# EasyEDA schematic SCH_STM32CRONOS_SQUEM.json

## Sheets
1 Sheet_1: TITLE: Sheet_1; REV: 1.0; Date: 2024-10-26; Sheet: 1/1; Drawn By: jbgs_ch_mex; Company: Your Company
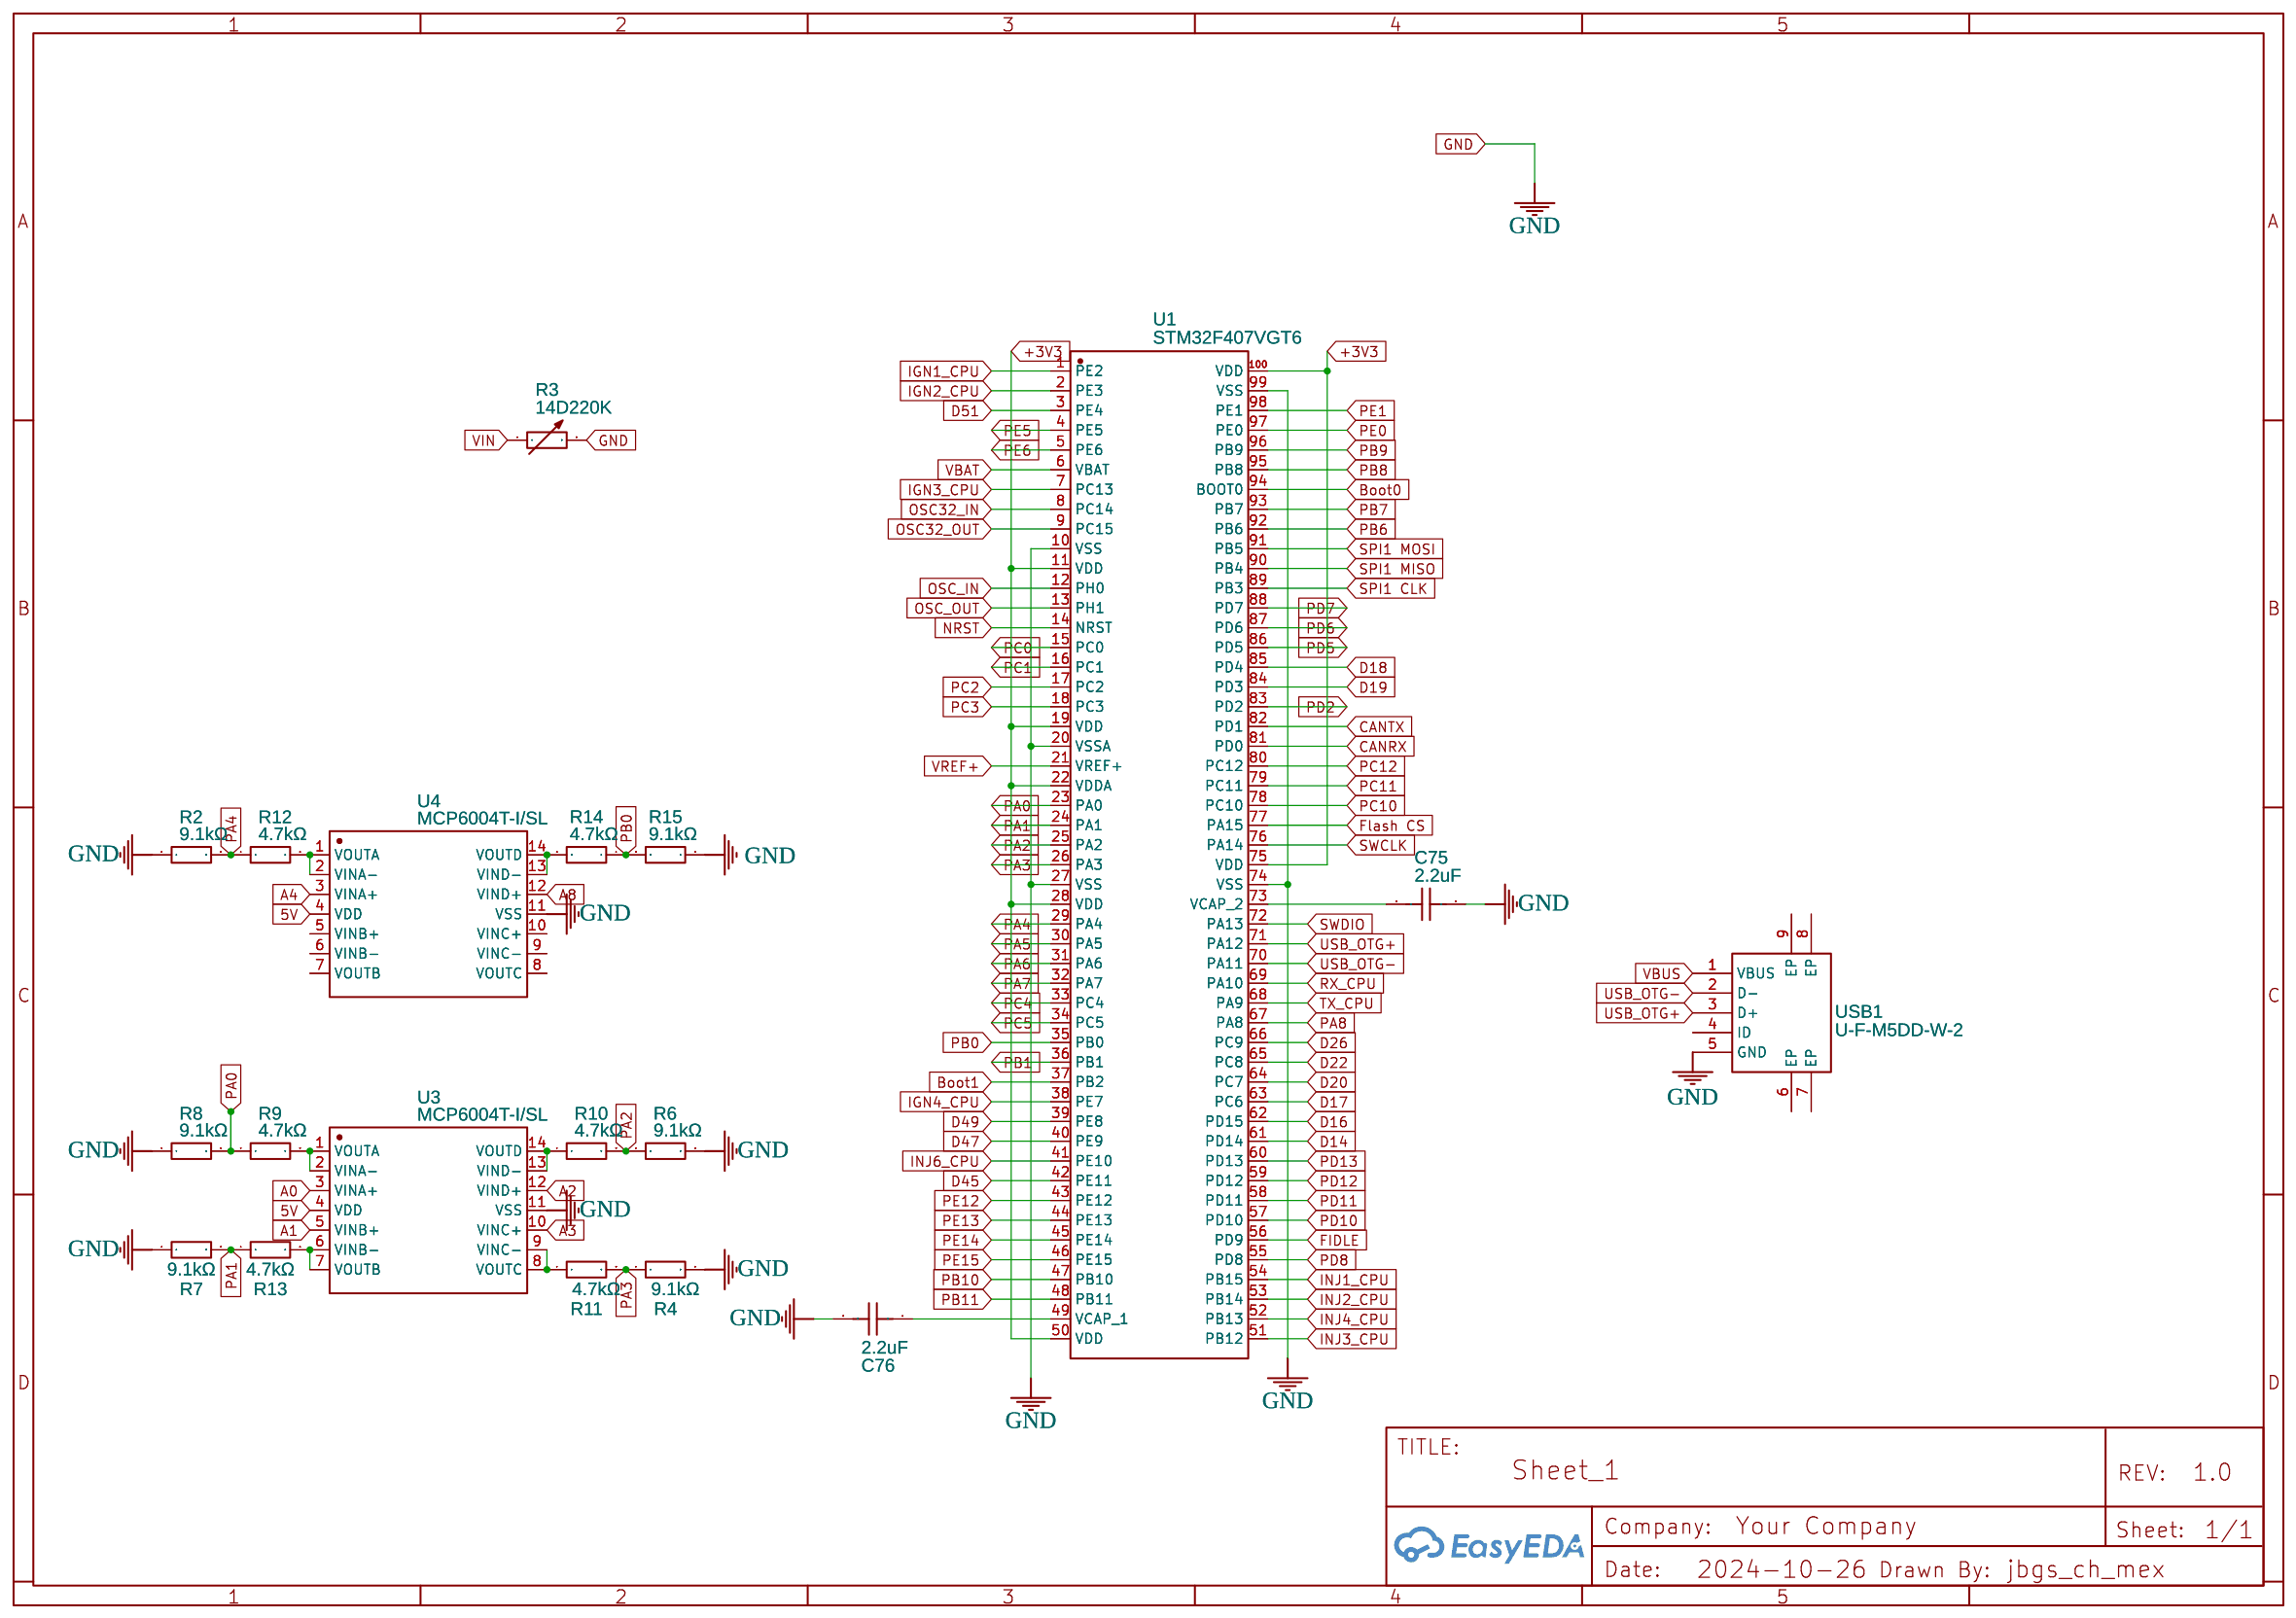
[diagram p0: Sheet_1]
2 Sheet_2: TITLE: Sheet_2
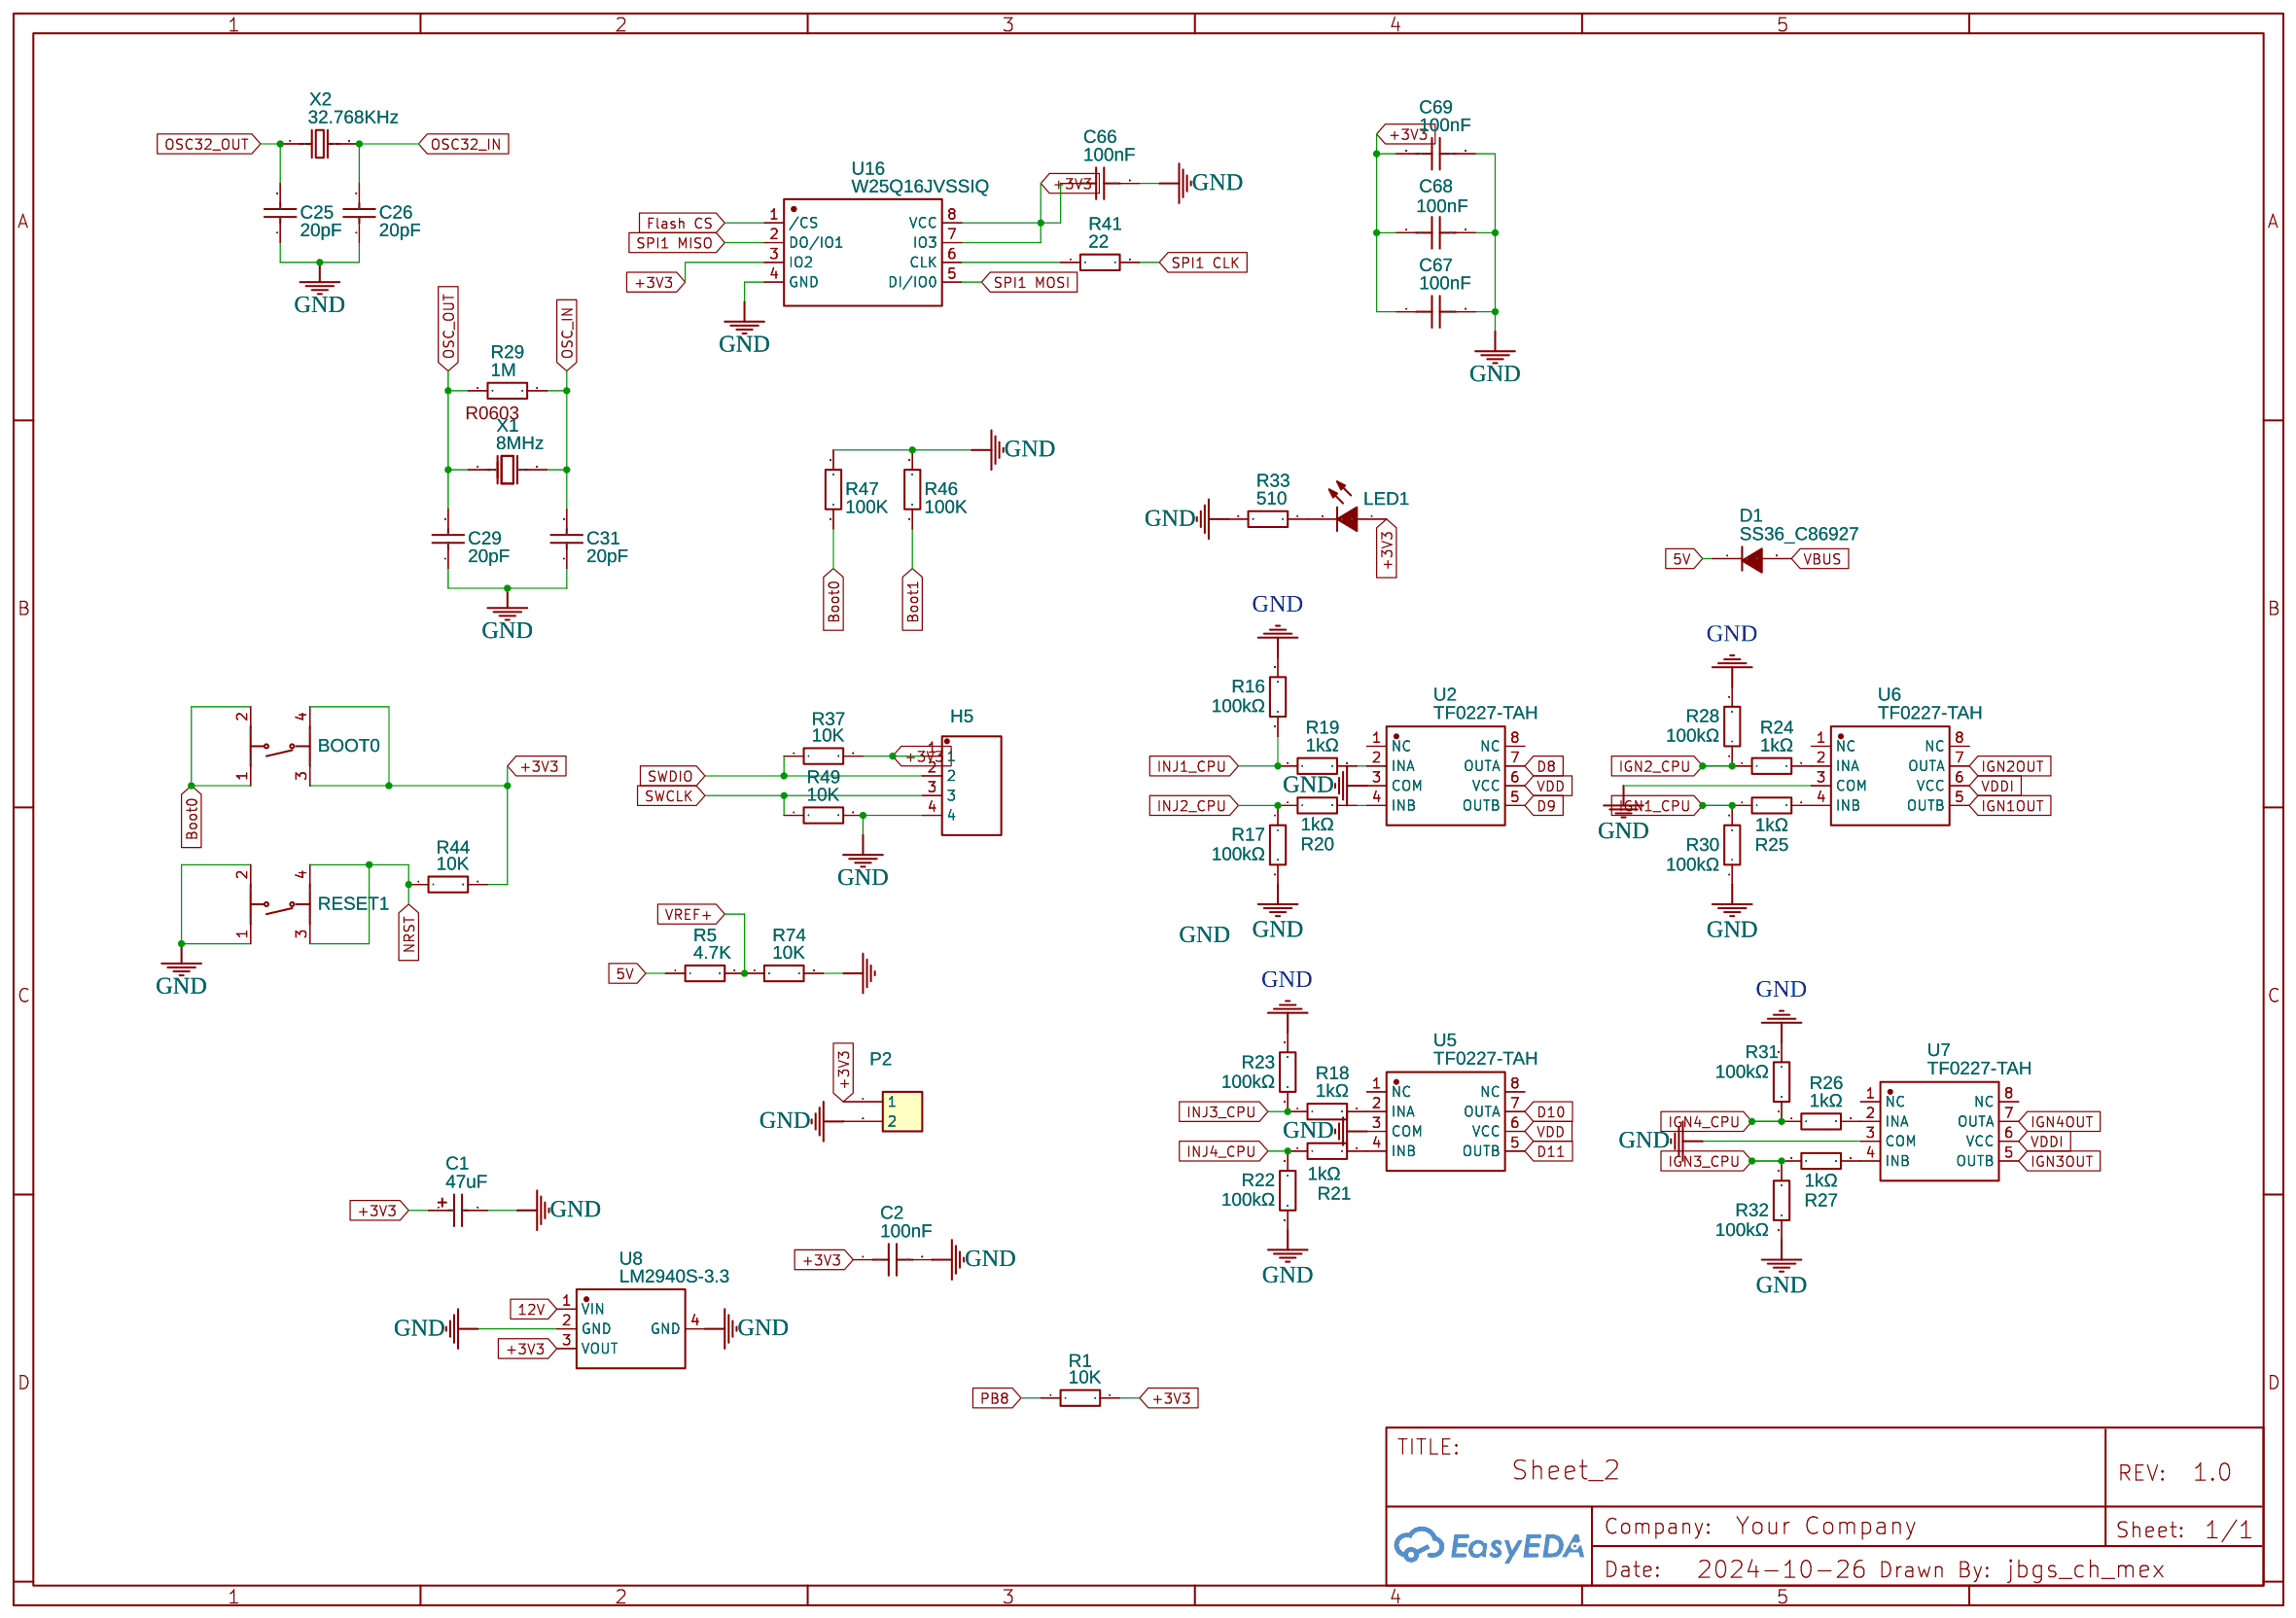
[diagram p1: Sheet_2]
3 Sheet_3: TITLE: Sheet_3
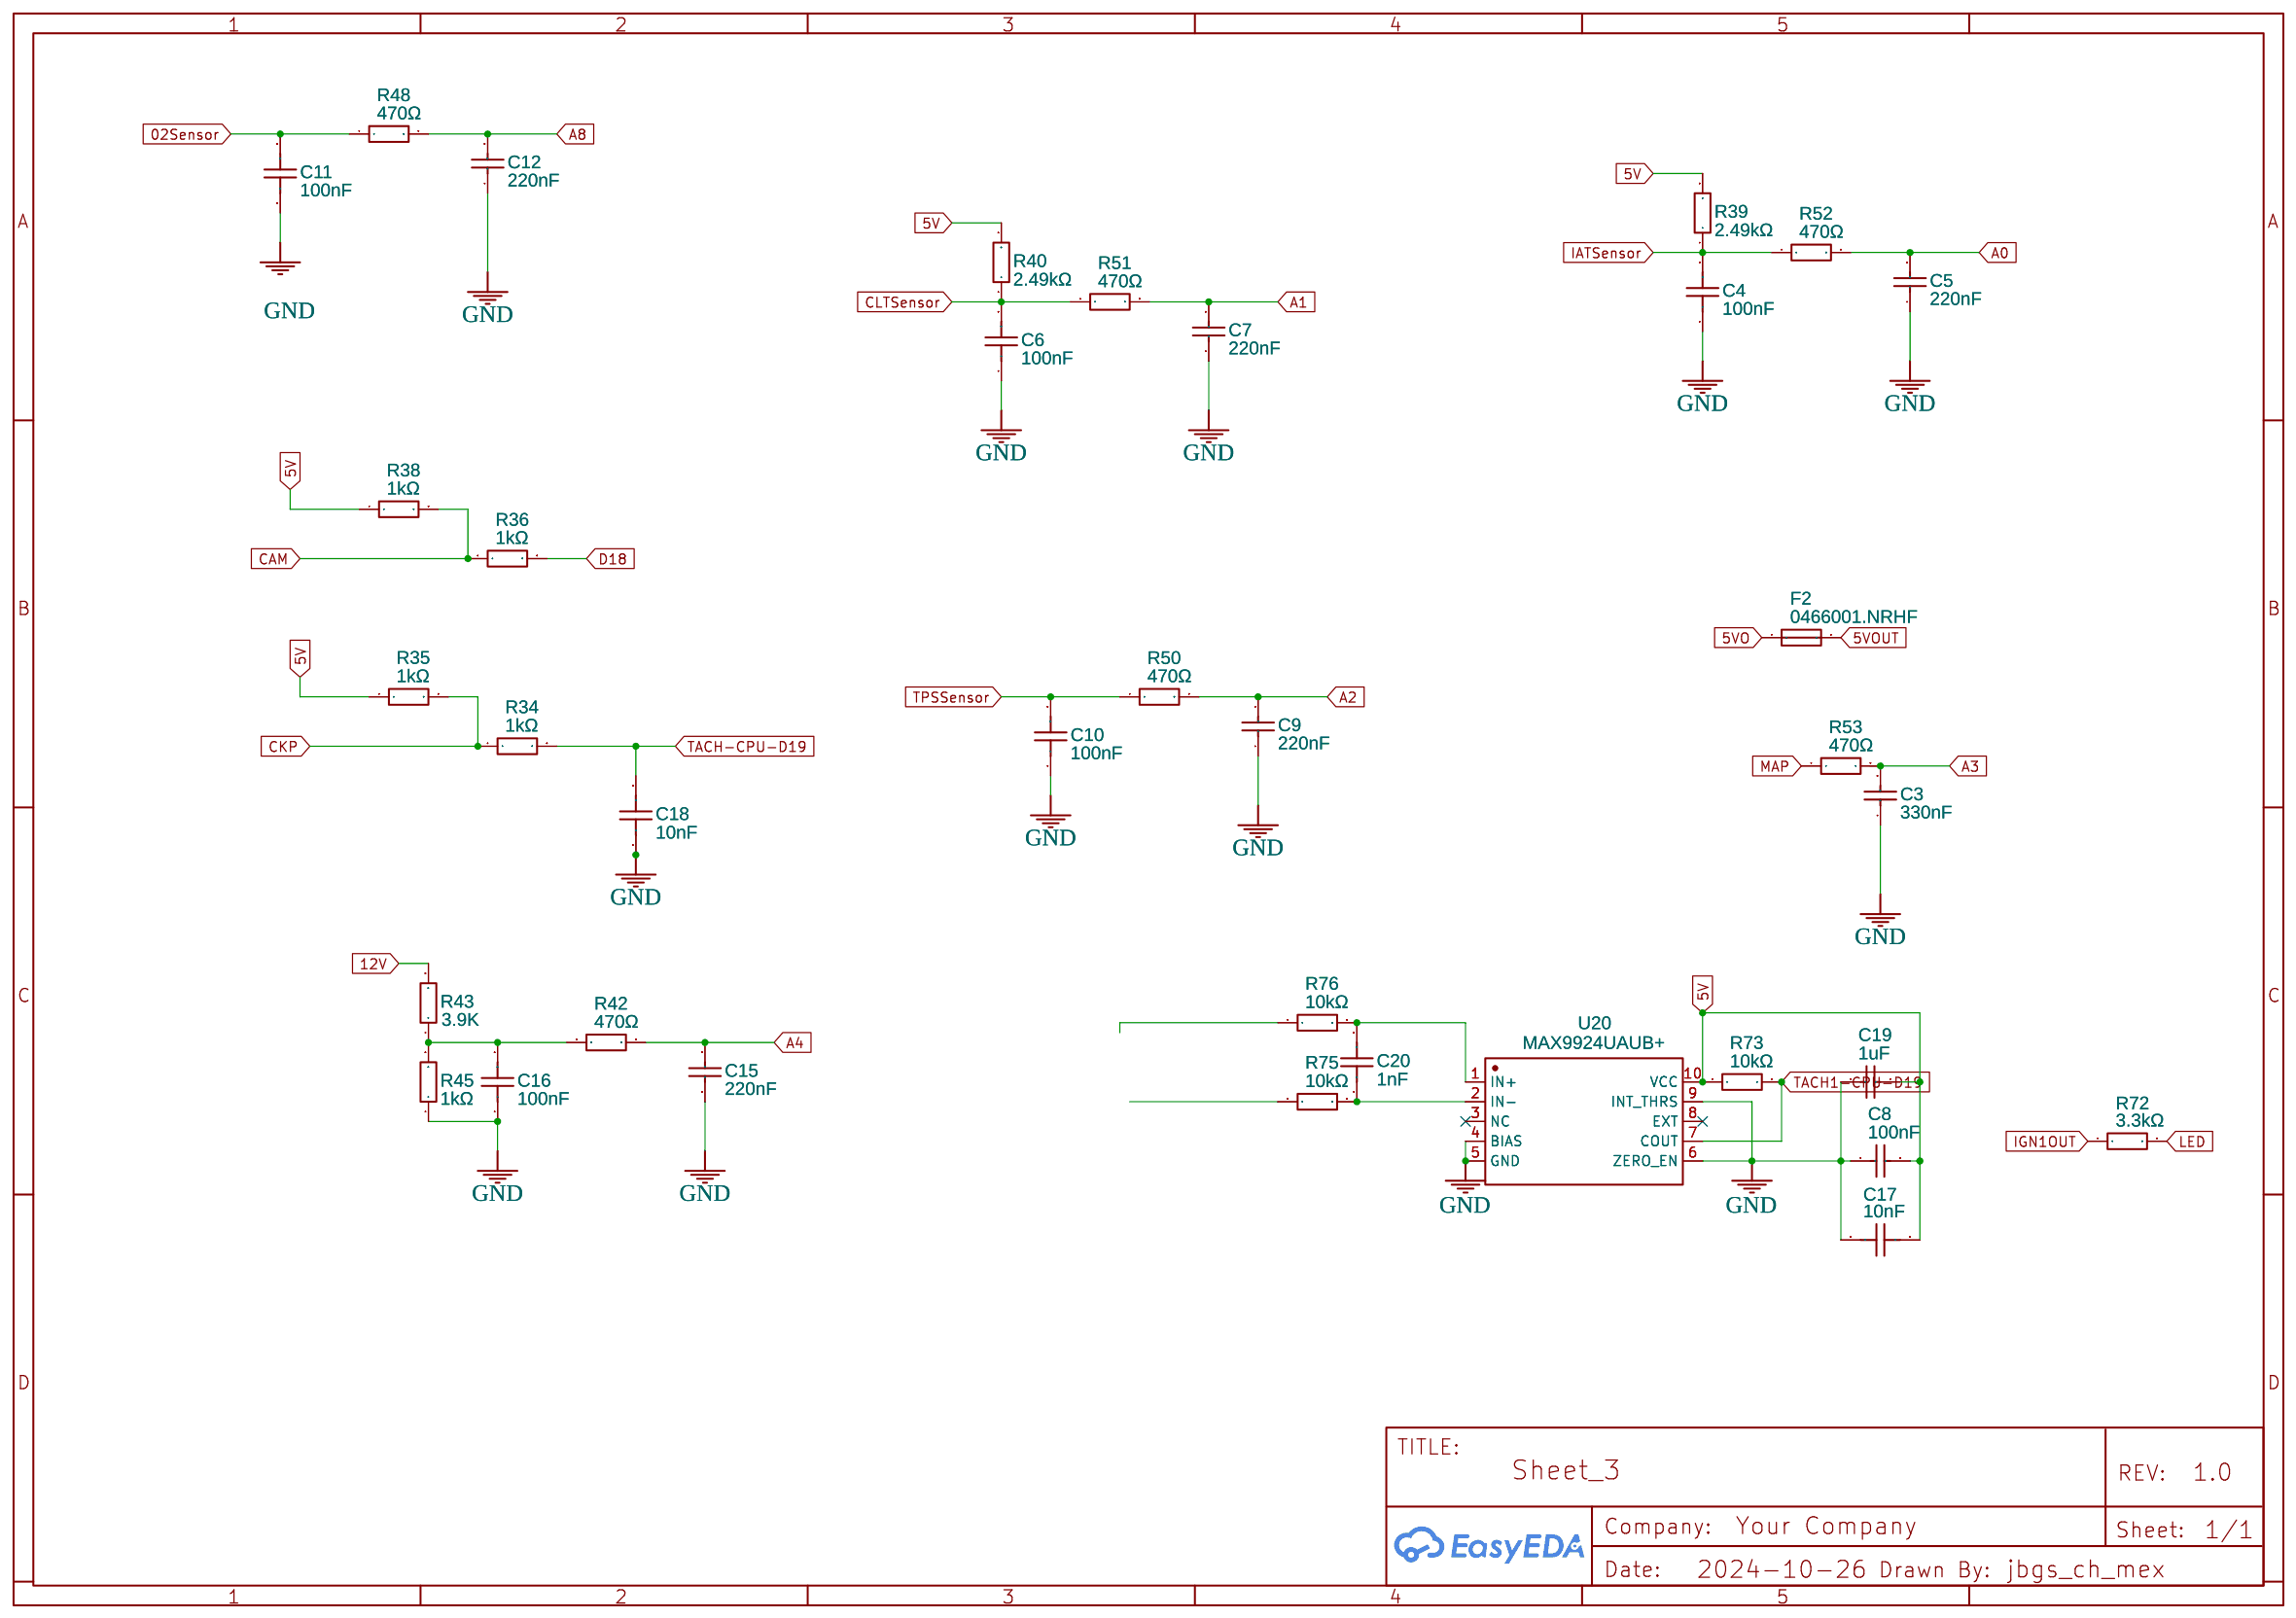
[diagram p2: Sheet_3]
4 Sheet_4: TITLE: Sheet_4
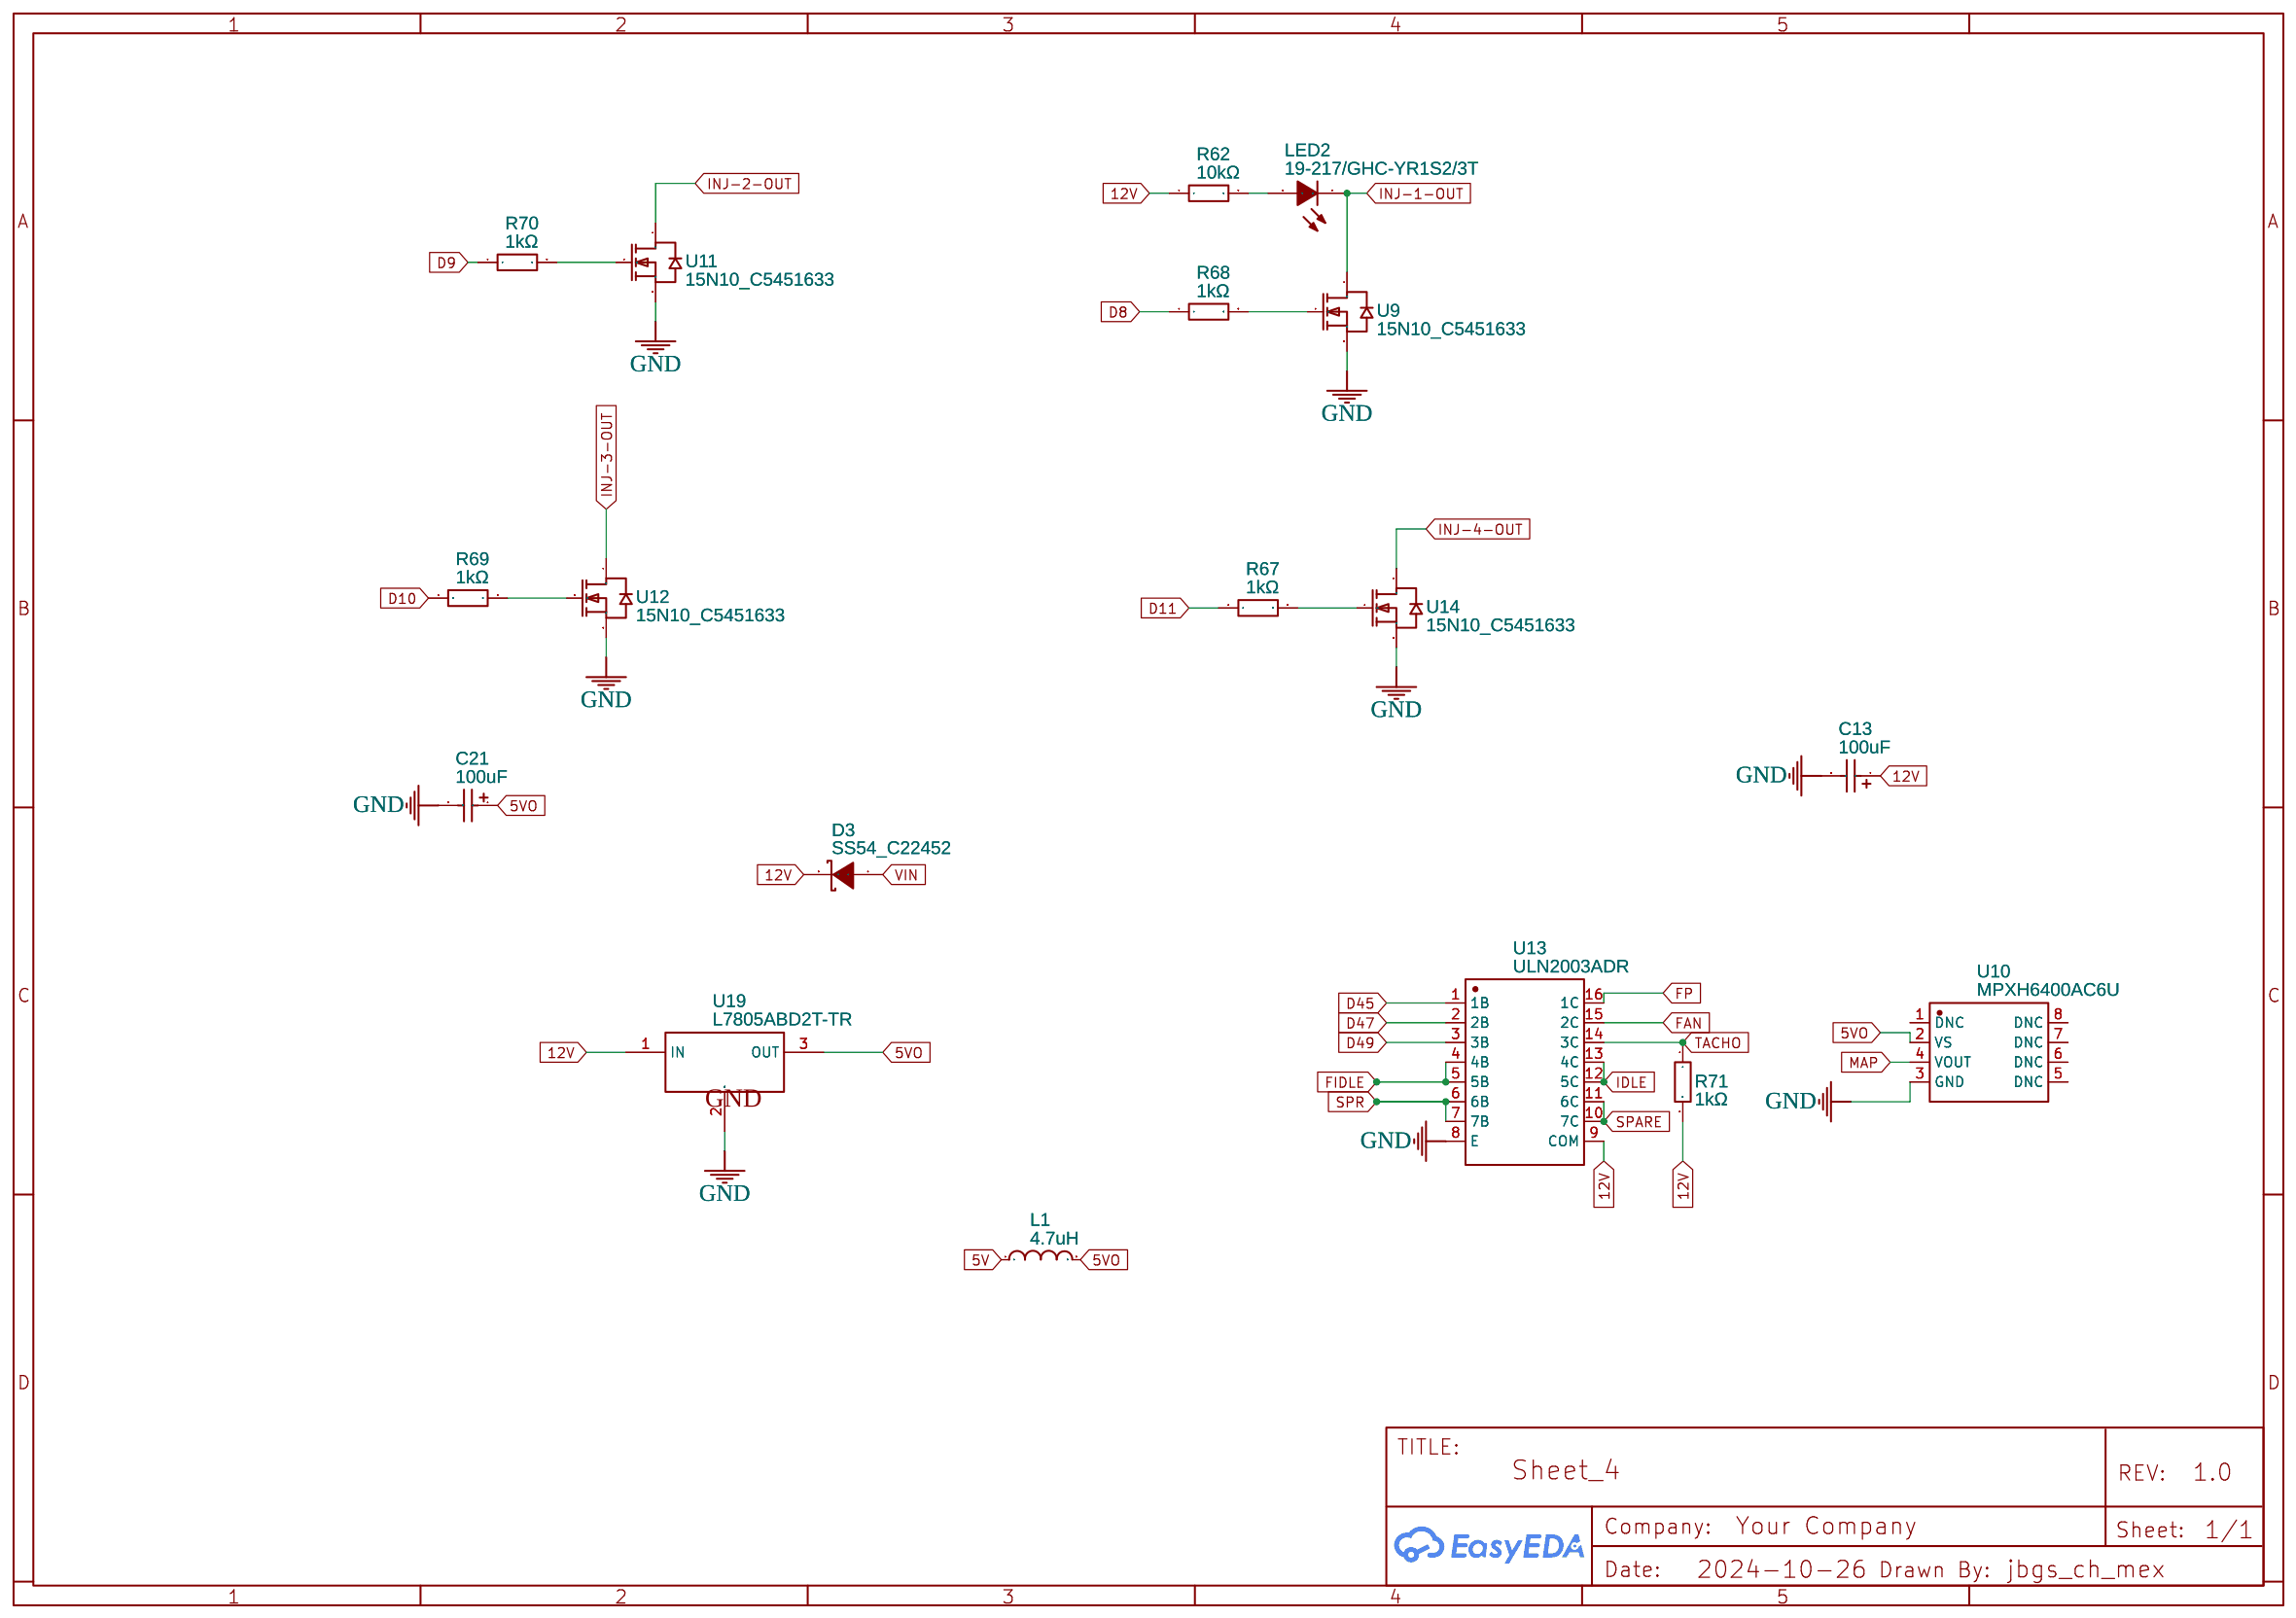
[diagram p3: Sheet_4]

## Parts
sheet Sheet_1
C75  2.2uF  [C0603]
C76  2.2uF  [C0603]
R2  9.1kΩ  [R0603]
R3  14D220K  [RES-TH_L16.5-W4.6-P7.50-D0.8-S2.40]
R4  9.1kΩ  [R0603]
R6  9.1kΩ  [R0603]
R7  9.1kΩ  [R0603]
R8  9.1kΩ  [R0603]
R9  4.7kΩ  [R0603]
R10  4.7kΩ  [R0603]
R11  4.7kΩ  [R0603]
R12  4.7kΩ  [R0603]
R13  4.7kΩ  [R0603]
R14  4.7kΩ  [R0603]
R15  9.1kΩ  [R0603]
U1  STM32F407VGT6  [LQFP-100_L14.0-W14.0-P0.50-LS16.0-BL]
U3  MCP6004T-I/SL  [SOIC-14_L8.7-W3.9-P1.27-LS6.0-BL]
U4  MCP6004T-I/SL  [SOIC-14_L8.7-W3.9-P1.27-LS6.0-BL]
USB1  U-F-M5DD-W-2  [MICRO-USB-SMD_MICRO-USB-A17]
sheet Sheet_2
BOOT0  TS-1089S-02526  [SW-SMD_4P-L4.2-W3.3-P2.15-LS5.1]
C1  47uF  [CASE-A_3216]
C2  100nF  [C0603]
C25  20pF  [C0603]
C26  20pF  [C0603]
C29  20pF  [C0603]
C31  20pF  [C0603]
C66  100nF  [C0603]
C67  100nF  [C0603]
C68  100nF  [C0603]
C69  100nF  [C0603]
D1  SS36_C86927  [SMA_L4.4-W2.6-LS5.0-RD]
H5  Header-Male-2.54_1x4_C124378  [HDR-TH_4P-P2.54-V]
LED1  19-217/BHC-ZL1M2RY/3T  [LED0603-R-RD]
P2  Female header1*2P copy  [HDR-2X1/2.0]
R1  10K  [R0603]
R5  4.7K  [R0603]
R16  100kΩ  [R0603]
R17  100kΩ  [R0603]
R18  1kΩ  [R0603]
R19  1kΩ  [R0603]
R20  1kΩ  [R0603]
R21  1kΩ  [R0603]
R22  100kΩ  [R0603]
R23  100kΩ  [R0603]
R24  1kΩ  [R0603]
R25  1kΩ  [R0603]
R26  1kΩ  [R0603]
R27  1kΩ  [R0603]
R28  100kΩ  [R0603]
R29  1M  [R0603]
R30  100kΩ  [R0603]
R31  100kΩ  [R0603]
R32  100kΩ  [R0603]
R33  510  [R0603]
R37  10K  [R0603]
R41  22  [R0603]
R44  10K  [R0603]
R46  100K  [R0603]
R47  100K  [R0603]
R49  10K  [R0603]
R74  10K  [R0603]
RESET1  TS-1089S-02526  [SW-SMD_4P-L4.2-W3.3-P2.15-LS5.1]
U2  TF0227-TAH  [SOIC-8_L4.9-W3.9-P1.27-LS6.0-BL]
U5  TF0227-TAH  [SOIC-8_L4.9-W3.9-P1.27-LS6.0-BL]
U6  TF0227-TAH  [SOIC-8_L4.9-W3.9-P1.27-LS6.0-BL]
U7  TF0227-TAH  [SOIC-8_L4.9-W3.9-P1.27-LS6.0-BL]
U8  LM2940S-3.3  [SOT-223-3_L6.5-W3.4-P2.30-LS7.0-BR]
U16  W25Q16JVSSIQ  [SOIC-8_L5.3-W5.3-P1.27-LS8.0-BL]
X1  8MHz  [OSC-SMD_L5.0-W3.2]
X2  32.768KHz  [FC-135R_L3.2-W1.5]
sheet Sheet_3
C3  330nF  [C0603]
C4  100nF  [C0603]
C5  220nF  [C0603]
C6  100nF  [C0603]
C7  220nF  [C0603]
C8  100nF  [C0805]
C9  220nF  [C0603]
C10  100nF  [C0603]
C11  100nF  [C0603]
C12  220nF  [C0603]
C15  220nF  [C0603]
C16  100nF  [C0603]
C17  10nF  [C0805]
C18  10nF  [C0805]
C19  1uF  [C0805]
C20  1nF  [C0805]
F2  0466001.NRHF  [F1206]
R34  1kΩ  [R0805]
R35  1kΩ  [R0805]
R36  1kΩ  [R0603]
R38  1kΩ  [R0603]
R39  2.49kΩ  [R0805]
R40  2.49kΩ  [R0805]
R42  470Ω  [R0603]
R43  3.9K  [R0603]
R45  1kΩ  [R0603]
R48  470Ω  [R0603]
R50  470Ω  [R0603]
R51  470Ω  [R0603]
R52  470Ω  [R0603]
R53  470Ω  [R0603]
R72  3.3kΩ  [R0805]
R73  10kΩ  [R0805]
R75  10kΩ  [R0805]
R76  10kΩ  [R0805]
U20  MAX9924UAUB+  [MSOP-10_L3.0-W3.0-P0.50-LS5.0-BL]
sheet Sheet_4
C13  100uF  [CAP-SMD_L7.3-W4.3-R-RD]
C21  100uF  [CASE-B_3528]
D3  SS54_C22452  [SMA_L4.4-W2.8-LS5.4-R-RD]
L1  4.7uH  [IND-SMD_L5.2-W5.1]
LED2  19-217/GHC-YR1S2/3T  [LED0603-RD]
R62  10kΩ  [R0805]
R67  1kΩ  [R0805]
R68  1kΩ  [R0805]
R69  1kΩ  [R0805]
R70  1kΩ  [R0805]
R71  1kΩ  [R0603]
U9  15N10_C5451633  [TO-252-2_L6.5-W6.1-P4.58-LS10.0-BR]
U10  MPXH6400AC6U  [SSOP-8_L8.5-W8.5-P1.27-LS10.2-BL]
U11  15N10_C5451633  [TO-252-2_L6.5-W6.1-P4.58-LS10.0-BR]
U12  15N10_C5451633  [TO-252-2_L6.5-W6.1-P4.58-LS10.0-BR]
U13  ULN2003ADR  [SOIC-16_L9.9-W3.9-P1.27-LS6.0-BL]
U14  15N10_C5451633  [TO-252-2_L6.5-W6.1-P4.58-LS10.0-BR]
U19  L7805ABD2T-TR  [TO-263-2_L10.0-W9.2-P5.08-LS15.3-TL-CW]

## Library data of the parts
C75 C76 = CL10A225KA8NNNC: Supplier: LCSC; Manufacturer: SAMSUNG; Supplier Part: C23630; LCSC Assembly: Yes; SMT Type: Extend
R2 R4 R6-R8 R15 = 0603WAF9101T5E: Supplier: LCSC; Manufacturer: UNI-ROYAL(厚声); Supplier Part: C23260
R3 = 14D220K: Supplier: LCSC; Manufacturer: HEL(鸿志); Supplier Part: C136782; JLCPCB Part Class: Extended Part
R9-R14 = RMC06034.7K1%N: Contributor: LCSC; Supplier: LCSC; Supplier Part: C23162; Manufacturer: Tyohm(幸亚电阻); Manufacturer Part: RMC06034K7FN; JLCPCB Part Class: Extended Part
U1 = STM32F407VGT6: tags: STM32; subpart_no: 1; Supplier Part: C12345; Supplier: LCSC; Manufacturer: ST(意法半导体); JLCPCB Part Class: Extended Part
U3 U4 = MCP6004T-I/SL: Supplier: LCSC; Manufacturer: MICROCHIP(美国微芯); Supplier Part: C7378; JLCPCB Part Class: Extended Part
USB1 = U-F-M5DD-W-2: Contributor: LCSC; Supplier: LCSC; Manufacturer: 韩国韩荣; Supplier Part: C145793; JLCPCB Part Class: Extended Part
BOOT0 RESET1 = TS-1089S-02526: Supplier: LCSC; Supplier Part: C455282; Manufacturer: XUNPU; Contributor: LCSC; LCSC Assembly: Yes; SMT Type: Extend; Package Display: No
C1 = TAJA476K006RNJ: Supplier: LCSC; Manufacturer: Kyocera AVX; Supplier Part: C7190; JLCPCB Part Class: Extended Part
C2 C4 C6 C10 C11 C16 = CC0603KRX7R9BB104: Supplier: LCSC; Manufacturer: YAGEO(国巨); Supplier Part: C14663; JLCPCB Part Class: Basic Part
C25 C26 = CL05C200JB5NNNC: Supplier: LCSC; Supplier Part: C1648; LCSC Assembly: Yes; SMT Type: Extend; Package Display: No
C29 C31 = CL05C200JB5NNNC: Supplier: LCSC; Supplier Part: C1634; LCSC Assembly: Yes; SMT Type: Extend; Package Display: No
C66-C69 = C0603X104K050T: Supplier: LCSC; Supplier Part: C14663; Manufacturer: Holy Stone Enterprise; Contributor: LCSC; LCSC Assembly: Yes
D1 = SS36_C86927: Supplier: LCSC; Manufacturer: DIYI(迪一/芯诺); Manufacturer Part: SS36; Supplier Part: C22452; JLCPCB Part Class: Extended Part
H5 = Header-Male-2.54_1x4_C124378: Supplier: LCSC; Manufacturer: Ckmtw; Manufacturer Part: 210S-1*4P L=11.6MMGold-plated black; Contributor: LCSC; Supplier Part: C124378
LED1 = 19-217/BHC-ZL1M2RY/3T: Supplier: LCSC; Manufacturer: EVERLIGHT; LCSC Assembly: Yes; image: //image.lceda.cn/szlcsc/C72041.jpg; Supplier Part: C2286; SMT Type: Basic; Package Display: No
P2 = Female header1*2P copy: Supplier: LCSC; Manufacturer: BOOMELE; Manufacturer Part: Female header1*2P; Supplier Part: C66509; Package Display: No
R1 R37 R49 = RC0402FR-0710KL: Supplier: LCSC; Manufacturer: YAGEO; Supplier Part: C25804; LCSC Assembly: Yes
R5 = 0603WAF4701T5E: Supplier: LCSC; Manufacturer: UniOhm; Supplier Part: C23162; SMT Type: Basic; JLCPCB SMD: Yes; LCSC Assembly: Yes; Package Display: No
R16 R17 R22 R23 R28 R30-R32 = 0603WAF1003T5E: Supplier: LCSC; Manufacturer: UNI-ROYAL(厚声); Supplier Part: C25803; JLCPCB Part Class: Basic Part
R18-R21 R24-R27 = 0603WAF1001T5E: Supplier: LCSC; Manufacturer: UNI-ROYAL(厚声); Supplier Part: C21190; JLCPCB Part Class: Basic Part
R29 = 0402WGF1004TCE: Supplier: LCSC; Manufacturer: UniOhm; LCSC Assembly: Yes; Supplier Part: C22935; SMT Type: Basic; Package Display: Yes
R33 = 0603WAF5100T5E: Supplier: LCSC; Manufacturer: UniOhm; Supplier Part: C23193; SMT Type: Basic; JLCPCB SMD: Yes; LCSC Assembly: Yes; Package Display: No
R41 = RC0402JR-0722RL: Supplier: LCSC; Manufacturer: YAGEO; Supplier Part: C23345; LCSC Assembly: Yes
R44 = RC0402FR-0710KL: Supplier: LCSC; Supplier Part: C25804; LCSC Assembly: Yes
R46 R47 = RC0603JR-07100KL: Supplier: LCSC; Supplier Part: C25803; Manufacturer: YAGEO; Contributor: LCSC; LCSC Assembly: Yes
R74 = 0603WAF1002T5E: Supplier: LCSC; Manufacturer: UniOhm; Supplier Part: C25804; SMT Type: Basic; JLCPCB SMD: Yes; LCSC Assembly: Yes; Package Display: No
U2 U5-U7 = TF0227-TAH: Contributor: LCSC; Supplier: LCSC; Supplier Part: C2836238; Manufacturer: TFSS(德律风根); JLCPCB Part Class: Extended Part
U8 = LM2940S-3.3: Contributor: LCSC; Supplier: LCSC; Supplier Part: C596335; Manufacturer: HTC; JLCPCB Part Class: Extended Part
U16 = W25Q16JVSSIQ: Supplier: LCSC; Supplier Part: C97521; LCSC Assembly: Yes; SMT Type: Extend
X1 = X50328MSB2GI: Supplier: LCSC; Manufacturer: YXC; Supplier Part: C115962; SMT Type: Basic; JLCPCB SMD: Yes; Package Display: No
X2 = Q13FC1350000400: Supplier: LCSC; Manufacturer: EPSON; LCSC Assembly: Yes; Supplier Part: C32346; SMT Type: Basic
C3 = 0603B334K250NT: Supplier: LCSC; Manufacturer: FH(风华); Supplier Part: C1615; JLCPCB Part Class: Basic Part
C5 C7 C9 C12 C15 = CL10B224KA8NNNC: Supplier: LCSC; Manufacturer: SAMSUNG(三星); Supplier Part: C21120; JLCPCB Part Class: Basic Part
C8 = CL21B104KCFNNNE: Supplier: LCSC; Manufacturer: SAMSUNG(三星); Supplier Part: C28233; JLCPCB Part Class: Basic Part
C17 = TCC0805X7R103K500DT: Contributor: LCSC; Supplier: LCSC; Supplier Part: C1710; Manufacturer: CCTC(三环); JLCPCB Part Class: Extended Part
C18 = C0805C103K1RAC7800: Contributor: LCSC; Supplier: LCSC; Supplier Part: C1710; Manufacturer: KEMET; JLCPCB Part Class: Extended Part; link: https://lcsc.com/eda_search?q=C141122&%26type=1&ref=editor
C19 = CC0805KKX7R9BB105: Supplier: LCSC; Manufacturer: YAGEO(国巨); Supplier Part: C28323; JLCPCB Part Class: Extended Part
C20 = CC0805KRX7RZBB102: Contributor: LCSC; Supplier: LCSC; Supplier Part: C46653; Manufacturer: YAGEO(国巨); JLCPCB Part Class: Extended Part
F2 = 0466001.NRHF: Contributor: LCSC; Supplier: LCSC; Supplier Part: C151135; Manufacturer: Littelfuse(美国力特); JLCPCB Part Class: Extended Part
R34 R35 = 0805W8F1001T5E: Supplier: LCSC; Manufacturer: UNI-ROYAL(厚声); Supplier Part: C17513; JLCPCB Part Class: Basic Part; link: https://lcsc.com/eda_search?q=C17513&%26type=1&ref=editor
R36 R38 R45 R71 = 0603WAF1001T5E: Supplier: LCSC; Manufacturer: UNI-ROYAL(厚声); Supplier Part: C21190; Resistance (Ohms): 1K; JLCPCB Part Class: Basic Part
R39 R40 = 0805W8F2491T5E: Supplier: LCSC; Manufacturer: UNI-ROYAL(厚声); Supplier Part: C17526; JLCPCB Part Class: Extended Part
R42 R48 R50-R53 = 0603WAF4700T5E: Supplier: LCSC; Manufacturer: UNI-ROYAL(厚声); Supplier Part: C23179; Resistance (Ohms): 470; JLCPCB Part Class: Basic Part
R43 = 0603WAF3901T5E: Supplier: LCSC; Manufacturer: UniOhm; Supplier Part: C23018; JLCPCB Part Class: Basic Part
R72 = 0805W8F3301T5E: Supplier: LCSC; Manufacturer: UNI-ROYAL(厚声); Supplier Part: C26010; JLCPCB Part Class: Basic Part
R62 R73 R75 R76 = 0805W8F1002T5E: Supplier: LCSC; Manufacturer: UNI-ROYAL(厚声); Supplier Part: C17414; JLCPCB Part Class: Basic Part
U20 = MAX9924UAUB+: Contributor: LCSC; Supplier: LCSC; Manufacturer: ADI(亚德诺)/MAXIM(美信); Supplier Part: C143633; JLCPCB Part Class: Extended Part
C13 = TAJD107M020RNJ: Supplier: LCSC; Manufacturer: Kyocera AVX; Supplier Part: C99373; JLCPCB Part Class: Extended Part
C21 = TAJB107K006RNJ: Supplier: LCSC; Manufacturer: Kyocera AVX; Supplier Part: C16133; JLCPCB Part Class: Basic Part
D3 = SS54_C22452: Supplier: LCSC; Manufacturer Part: SS54; Manufacturer: MDD(辰达半导体); Supplier Part: C22452
L1 = YSPI0530-4R7M: Contributor: LCSC; Supplier: LCSC; Supplier Part: C351098; Manufacturer: YJYCOIN(益嘉源); JLCPCB Part Class: Extended Part
LED2 = 19-217/GHC-YR1S2/3T: Supplier: LCSC; Manufacturer: EVERLIGHT(亿光); Supplier Part: C2286; JLCPCB Part Class: Basic Part; link: https://lcsc.com/eda_search?q=C72043&%26type=1&ref=editor
R67-R70 = 0805W8F1001T5E: Supplier: LCSC; Manufacturer: UNI-ROYAL(厚声); Supplier Part: C17513; JLCPCB Part Class: Basic Part
U9 U11 U12 U14 = 15N10_C5451633: Contributor: lcsc; Supplier: LCSC; Supplier Part: C5451633; Manufacturer: HXY MOSFET(华轩阳电子); Manufacturer Part: 15N10; JLCPCB Part Class: Extended Part
U10 = MPXH6400AC6U: Contributor: lcsc; Supplier: LCSC; Supplier Part: C5202498; Manufacturer: NXP(恩智浦); JLCPCB Part Class: Extended Part
U13 = ULN2003ADR: Supplier: LCSC; Manufacturer: TI(德州仪器); Supplier Part: C7512; JLCPCB Part Class: Basic Part; Contributor: lcsc; 3DModel: SOIC-16_L9.9-W3.9-H1.8-LS6.0-P1.27; link: https://lcsc.com/eda_search?q=C7512&%26type=1&ref=editor
U19 = L7805ABD2T-TR: Supplier: LCSC; Manufacturer: ST(意法半导体); Supplier Part: C86206; JLCPCB Part Class: Extended Part

## Nets
5V: C8.2 C17.1 C19.2 D1.1(C) L1.1 R5.1 R35.1 R38.1 R39.2 R40.2 R73.1 U3.4(VDD) U4.4(VDD) U20.10(VCC)
5VO: C21.1 F2.1 L1.2 U10.2(VS) U19.3(OUT)
5VOUT: F2.2
12V: C13.1 D3.2(K) R43.2 R62.1 R71.2 U8.1(VIN) U13.9(COM) U19.1(IN)
+3V3: BOOT0.3 BOOT0.4 C1.1 C2.1 C66.1 C67.1 C68.1 C69.1 H5.1 LED1.1(A) P2.1 R1.2 R37.2 R44.2 U1.11(VDD) U1.19(VDD) U1.22(VDDA) U1.28(VDD) U1.50(VDD) U1.75(VDD) U1.100(VDD) U8.3(VOUT) U16.3(IO2) U16.7(IO3) U16.8(VCC)
GND: C1.2 C2.2 C3.1 C4.1 C5.1 C6.1 C7.1 C8.1 C9.1 C10.1 C11.1 C12.1 C13.2 C15.1 C16.1 C17.2 C18.1 C19.1 C21.2 C25.1 C26.1 C29.1 C31.1 C66.2 C67.2 C68.2 C69.2 C75.1 C76.2 H5.4 P2.2 R2.1 R3.2 R4.2 R6.2 R7.1 R8.1 R15.1 R16.2 R17.2 R22.2 R23.2 R28.2 R30.1 R31.2 R32.1 R33.2 R45.1 R46.2 R47.2 R49.2 R74.2 RESET1.1 RESET1.2 U1.10(VSS) U1.20(VSSA) U1.27(VSS) U1.74(VSS) U1.99(VSS) U2.3(COM) U3.11(VSS) U4.11(VSS) U5.3(COM) U6.3(COM) U7.3(COM) U8.2(GND) U8.4(GND) U9.3(S) U10.3(GND) U11.3(S) U12.3(S) U13.8(E) U14.3(S) U16.4(GND) U19.2(GND) U20.4(BIAS) U20.5(GND) U20.6(ZERO_EN) U20.9(INT_THRS) USB1.5(GND)
VBAT: U1.6(VBAT)
VBUS: D1.2(A) USB1.1(VBUS)
VDD: U2.6(VCC) U5.6(VCC)
VDDI: U6.6(VCC) U7.6(VCC)
VIN: D3.1(A) R3.1
02Sensor: C11.2 R48.1
A0: C5.2 R52.2 U3.3(VINA+)
A1: C7.2 R51.2 U3.5(VINB+)
A2: C9.2 R50.2 U3.12(VIND+)
A3: C3.2 R53.2 U3.10(VINC+)
A4: C15.2 R42.2 U4.3(VINA+)
A8: C12.2 R48.2 U4.12(VIND+)
Boot0: BOOT0.1 BOOT0.2 R47.1 U1.94(BOOT0)
Boot1: R46.1 U1.37(PB2)
CAM: R36.1 R38.2
CANRX: U1.81(PD0)
CANTX: U1.82(PD1)
CKP: R34.1 R35.2
CLTSensor: C6.2 R40.1 R51.1
D8: R68.1 U2.7(OUTA)
D9: R70.1 U2.5(OUTB)
D10: R69.1 U5.7(OUTA)
D11: R67.1 U5.5(OUTB)
D14: U1.61(PD14)
D16: U1.62(PD15)
D17: U1.63(PC6)
D18: R36.2 U1.85(PD4)
D19: U1.84(PD3)
D20: U1.64(PC7)
D22: U1.65(PC8)
D26: U1.66(PC9)
D45: U1.42(PE11) U13.1(1B)
D47: U1.40(PE9) U13.2(2B)
D49: U1.39(PE8) U13.3(3B)
D51: U1.3(PE4)
FAN: U13.15(2C)
FIDLE: U1.56(PD9) U13.4(4B) U13.5(5B)
Flash CS: U1.77(PA15) U16.1(/CS)
FP: U13.16(1C)
IATSensor: C4.2 R39.1 R52.1
IDLE: U13.12(5C) U13.13(4C)
IGN1_CPU: R25.1 R30.2 U1.1(PE2)
IGN1OUT: R72.1 U6.5(OUTB)
IGN2_CPU: R24.1 R28.1 U1.2(PE3)
IGN2OUT: U6.7(OUTA)
IGN3_CPU: R27.1 R32.2 U1.7(PC13)
IGN3OUT: U7.5(OUTB)
IGN4_CPU: R26.1 R31.1 U1.38(PE7)
IGN4OUT: U7.7(OUTA)
INJ1_CPU: R16.1 R19.1 U1.54(PB15)
INJ2_CPU: R17.1 R20.1 U1.53(PB14)
INJ3_CPU: R18.1 R23.1 U1.51(PB12)
INJ4_CPU: R21.1 R22.1 U1.52(PB13)
INJ6_CPU: U1.41(PE10)
INJ-1-OUT: LED2.1(C) U9.4(D)
INJ-2-OUT: U11.4(D)
INJ-3-OUT: U12.4(D)
INJ-4-OUT: U14.4(D)
LED: R72.2
MAP: R53.1 U10.4(VOUT)
NRST: R44.1 RESET1.3 RESET1.4 U1.14(NRST)
OSC32_IN: C26.2 U1.8(PC14) X2.2
OSC32_OUT: C25.2 U1.9(PC15) X2.1
OSC_IN: C31.2 R29.1 U1.12(PH0) X1.2(OSC2)
OSC_OUT: C29.2 R29.2 U1.13(PH1) X1.1(OSC1)
PA0: R8.2 R9.1 U1.23(PA0)
PA1: R7.2 R13.1 U1.24(PA1)
PA2: R6.1 R10.2 U1.25(PA2)
PA3: R4.1 R11.2 U1.26(PA3)
PA4: R2.2 R12.1 U1.29(PA4)
PA5: U1.30(PA5)
PA6: U1.31(PA6)
PA7: U1.32(PA7)
PA8: U1.67(PA8)
PB0: R14.1 R15.2 U1.35(PB0)
PB1: U1.36(PB1)
PB6: U1.92(PB6)
PB7: U1.93(PB7)
PB8: R1.1 U1.95(PB8)
PB9: U1.96(PB9)
PB10: U1.47(PB10)
PB11: U1.48(PB11)
PC0: U1.15(PC0)
PC1: U1.16(PC1)
PC2: U1.17(PC2)
PC3: U1.18(PC3)
PC4: U1.33(PC4)
PC5: U1.34(PC5)
PC10: U1.78(PC10)
PC11: U1.79(PC11)
PC12: U1.80(PC12)
PD2: U1.83(PD2)
PD5: U1.86(PD5)
PD6: U1.87(PD6)
PD7: U1.88(PD7)
PD8: U1.55(PD8)
PD10: U1.57(PD10)
PD11: U1.58(PD11)
PD12: U1.59(PD12)
PD13: U1.60(PD13)
PE0: U1.97(PE0)
PE1: U1.98(PE1)
PE5: U1.4(PE5)
PE6: U1.5(PE6)
PE12: U1.43(PE12)
PE13: U1.44(PE13)
PE14: U1.45(PE14)
PE15: U1.46(PE15)
RX_CPU: U1.69(PA10)
SPARE: U13.10(7C) U13.11(6C)
SPI1 CLK: R41.2 U1.89(PB3)
SPI1 MISO: U1.90(PB4) U16.2(DO/IO1)
SPI1 MOSI: U1.91(PB5) U16.5(DI/IO0)
SPR: U13.6(6B) U13.7(7B)
SWCLK: H5.3 R49.1 U1.76(PA14)
SWDIO: H5.2 R37.1 U1.72(PA13)
TACH1-CPU-D19: R73.2 U20.7(COUT)
TACH-CPU-D19: C18.2 R34.2
TACHO: R71.1 U13.14(3C)
TPSSensor: C10.2 R50.1
TX_CPU: U1.68(PA9)
USB_OTG+: U1.71(PA12) USB1.3(D+)
USB_OTG-: U1.70(PA11) USB1.2(D-)
VREF+: R5.2 R74.1 U1.21(VREF+)
Net-(C16-2): C16.2 R42.1 R43.1 R45.2
Net-(C20-1): C20.1 R75.2 U20.2(IN-)
Net-(C20-2): C20.2 R76.2 U20.1(IN+)
Net-(C75-2): C75.2 U1.73(VCAP_2)
Net-(C76-1): C76.1 U1.49(VCAP_1)
Net-(LED1-2): LED1.2(C) R33.1
Net-(LED2-2): LED2.2(A) R62.2
Net-(R9-2): R9.2 U3.1(VOUTA) U3.2(VINA-)
Net-(R10-1): R10.1 U3.13(VIND-) U3.14(VOUTD)
Net-(R11-1): R11.1 U3.8(VOUTC) U3.9(VINC-)
Net-(R12-2): R12.2 U4.1(VOUTA) U4.2(VINA-)
Net-(R13-2): R13.2 U3.6(VINB-) U3.7(VOUTB)
Net-(R14-2): R14.2 U4.13(VIND-) U4.14(VOUTD)
Net-(R18-2): R18.2 U5.2(INA)
Net-(R19-2): R19.2 U2.2(INA)
Net-(R20-2): R20.2 U2.4(INB)
Net-(R21-2): R21.2 U5.4(INB)
Net-(R24-2): R24.2 U6.2(INA)
Net-(R25-2): R25.2 U6.4(INB)
Net-(R26-2): R26.2 U7.2(INA)
Net-(R27-2): R27.2 U7.4(INB)
Net-(R41-1): R41.1 U16.6(CLK)
Net-(R67-2): R67.2 U14.1(G)
Net-(R68-2): R68.2 U9.1(G)
Net-(R69-2): R69.2 U12.1(G)
Net-(R70-2): R70.2 U11.1(G)

Not connected (* = marked no-connect by the designer): R75 1; R76 1; U2 1(NC) 8(NC); U4 5(VINB+) 6(VINB-) 7(VOUTB) 8(VOUTC) 9(VINC-) 10(VINC+); U5 1(NC) 8(NC); U6 1(NC) 8(NC); U7 1(NC) 8(NC); U10 1(DNC) 5(DNC) 6(DNC) 7(DNC) 8(DNC); U20 3(NC)* 8(EXT)*; USB1 4(ID) 6(EP) 7(EP) 8(EP) 9(EP)
